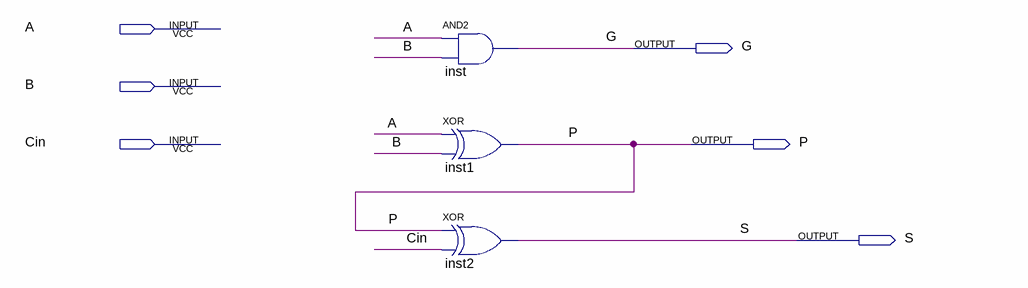
[diagram p0: schematic sheet]
// Quartus schematic adderUnit.bdf as structural Verilog: 3 symbols, 6 pins
module adderUnit (
  input  A,
  input  B,
  input  Cin,
  output G,
  output P,
  output S
);

  and inst (G, A, B);
  xor inst1 (P, A, B);
  xor inst2 (S, P, Cin);
endmodule
